# EAGLE design A3938 (EAGLE 4.16)
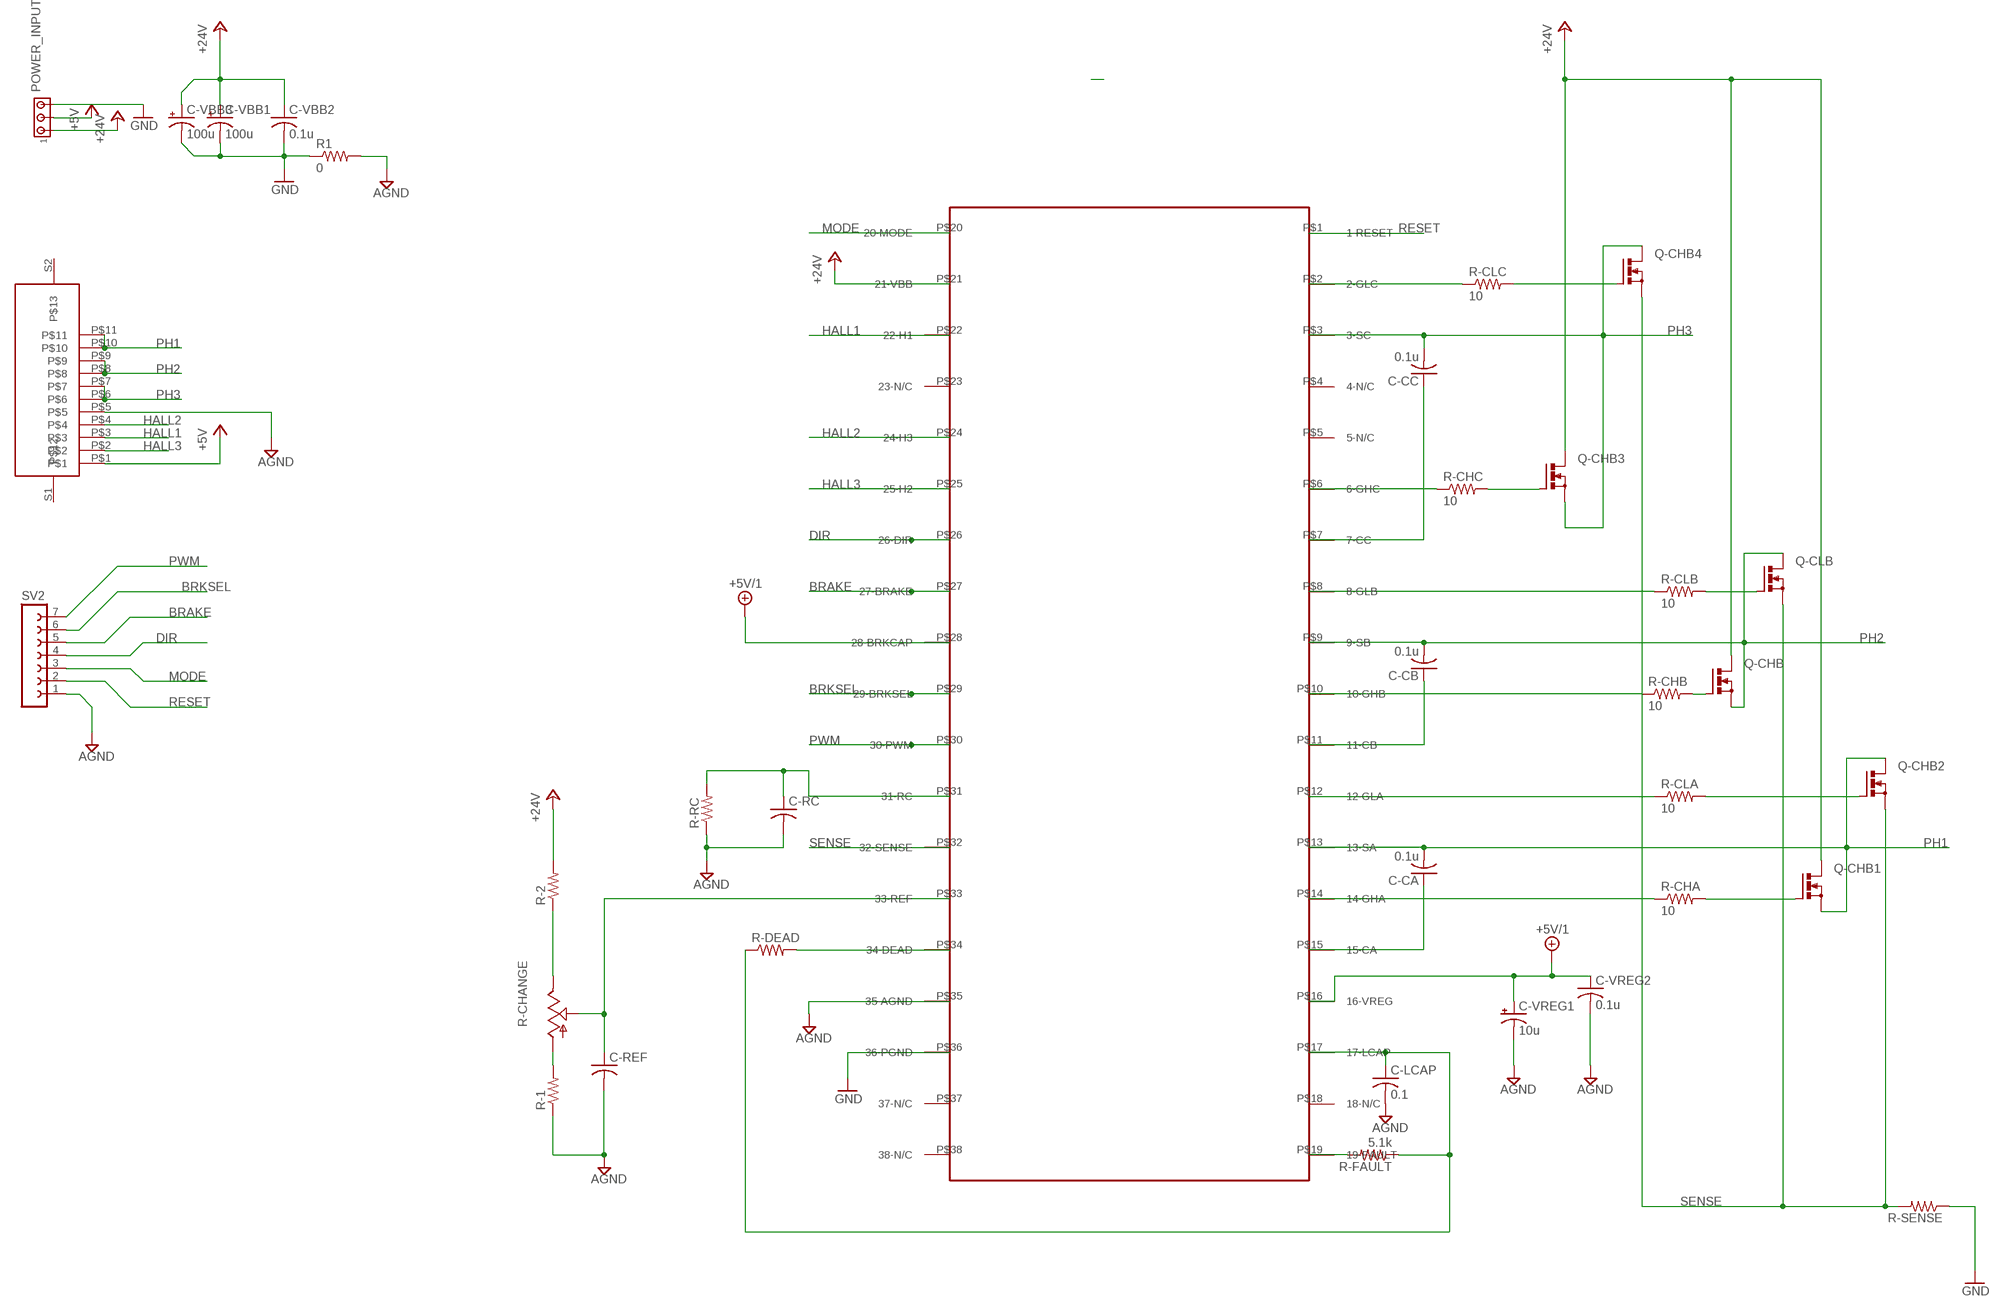
[diagram p0: schematic, sheet 1]

## Parts
C-CA  0.1u  C-USC0805  [C0805]
C-CB  0.1u  C-USC0805  [C0805]
C-CC  0.1u  C-USC0805  [C0805]
C-LCAP  0.1  C-USC0805  [C0805]
C-RC  C-USC0805  [C0805]
C-REF  C-USC0805  [C0805]
C-VBB1  100u  CPOL-USE2.5-5  [E2,5-5]
C-VBB2  0.1u  C-USC0805  [C0805]
C-VBB3  100u  CPOL-USE2.5-5  [E2,5-5]
C-VREG1  10u  CPOL-USE2.5-5  [E2,5-5]
C-VREG2  0.1u  C-USC0805  [C0805]
POWER_INPUT  MTA03-100  [10X03MTA]
Q-CHB  PMOSFET_NTO220BV  [TO220BV]
Q-CHB1  PMOSFET_NTO220BV  [TO220BV]
Q-CHB2  PMOSFET_NTO220BV  [TO220BV]
Q-CHB3  PMOSFET_NTO220BV  [TO220BV]
Q-CHB4  PMOSFET_NTO220BV  [TO220BV]
Q-CLB  PMOSFET_NTO220BV  [TO220BV]
R1  0  R-US_R0805  [R0805]
R-1  R-US_R0805  [R0805]
R-2  R-US_R0805  [R0805]
R-CHA  10  R-US_R0805  [R0805]
R-CHANGE  TRIM_US-B25U  [B25U]
R-CHB  10  R-US_R0805  [R0805]
R-CHC  10  R-US_R0805  [R0805]
R-CLA  10  R-US_R0805  [R0805]
R-CLB  10  R-US_R0805  [R0805]
R-CLC  10  R-US_R0805  [R0805]
R-DEAD  R-US_R0805  [R0805]
R-FAULT  5.1k  R-US_R0805  [R0805]
R-RC  R-US_R0805  [R0805]
R-SENSE  R-US_R0805  [R0805]
SV2  FE07-1  [FE07]
U$1  MAINCHIP  [MAINCHIP]
U$2  MOTORCONNECT  [53261-11]

## Nets
+5V: POWER_INPUT.2 U$2.P$1
+5V/1: C-VREG1.+ C-VREG2.1 U$1.P$16(16-VREG) U$1.P$28(28-BRKCAP)
+24V: C-VBB1.+ C-VBB2.1 C-VBB3.+ POWER_INPUT.1 Q-CHB1.D Q-CHB3.D Q-CHB.D R-2.2 U$1.P$21(21-VBB)
AGND: C-LCAP.2 C-RC.2 C-REF.2 C-VREG1.- C-VREG2.2 R1.2 R-1.1 R-RC.1 SV2.1 U$1.P$35(35-AGND) U$2.P$5
BRAKE: SV2.5 U$1.P$27(27-BRAKE)
BRKSEL: SV2.6 U$1.P$29(29-BRKSEL)
DIR: SV2.4 U$1.P$26(26-DIR)
GND: C-VBB1.- C-VBB2.2 C-VBB3.- POWER_INPUT.3 R1.1 R-SENSE.1 U$1.P$36(36-PGND)
HALL1: U$1.P$22(22-H1) U$2.P$3
HALL2: U$1.P$24(24-H3) U$2.P$4
HALL3: U$1.P$25(25-H2) U$2.P$2
LCAP: C-LCAP.1 R-DEAD.1 R-FAULT.1 U$1.P$17(17-LCAP)
MODE: SV2.3 U$1.P$20(20-MODE)
N$1: R-CLC.1 U$1.P$2(2-GLC)
N$2: R-CHC.1 U$1.P$6(6-GHC)
N$3: Q-CHB3.G R-CHC.2
N$4: Q-CHB4.G R-CLC.2
N$5: Q-CHB.G R-CHB.2
N$6: R-CHB.1 U$1.P$10(10-GHB)
N$7: R-CLB.1 U$1.P$8(8-GLB)
N$8: R-CHA.1 U$1.P$14(14-GHA)
N$9: R-FAULT.2 U$1.P$19(19-FAULT)
N$10: C-CA.1 U$1.P$15(15-CA)
N$11: Q-CHB1.G R-CHA.2
N$15: R-CLA.1 U$1.P$12(12-GLA)
N$16: Q-CHB2.G R-CLA.2
N$17: C-RC.1 R-RC.2 U$1.P$31(31-RC)
N$18: C-CB.1 U$1.P$11(11-CB)
N$19: C-CC.1 U$1.P$7(7-CC)
N$20: Q-CLB.G R-CLB.2
N$22: R-DEAD.2 U$1.P$34(34-DEAD)
N$24: C-REF.1 R-CHANGE.S U$1.P$33(33-REF)
N$30: R-2.1 R-CHANGE.E
N$31: R-1.2 R-CHANGE.A
PH1: C-CA.2 Q-CHB1.S Q-CHB2.D U$1.P$13(13-SA) U$2.P$10 U$2.P$11
PH2: C-CB.2 Q-CHB.S Q-CLB.D U$1.P$9(9-SB) U$2.P$8 U$2.P$9
PH3: C-CC.2 Q-CHB3.S Q-CHB4.D U$1.P$3(3-SC) U$2.P$6 U$2.P$7
PWM: SV2.7 U$1.P$30(30-PWM)
RESET: SV2.2 U$1.P$1(1-RESET)
SENSE: Q-CHB2.S Q-CHB4.S Q-CLB.S R-SENSE.2 U$1.P$32(32-SENSE)
Unconnected: U$1.P$4(4-N/C) U$1.P$5(5-N/C) U$1.P$18(18-N/C) U$1.P$23(23-N/C) U$1.P$37(37-N/C) U$1.P$38(38-N/C) U$2.S1 U$2.S2

## Library data of the parts
C-CA C-CB C-CC C-LCAP C-RC C-REF C-VBB2 C-VREG2 = rcl:C-US: CAPACITOR, American symbol
C-VBB1 C-VBB3 C-VREG1 = rcl:CPOL-US: POLARIZED CAPACITOR, American symbol
POWER_INPUT = con-amp:MTA03-100: AMP connector
Q-CHB Q-CHB1-Q-CHB4 Q-CLB = transistor-power:PMOSFET_N: Power MOSFET N-Channel
R1 R-1 R-2 R-CHA R-CHB R-CHC R-CLA R-CLB R-CLC R-DEAD R-FAULT R-RC R-SENSE = rcl:R-US_: RESISTOR, American symbol
R-CHANGE = pot:TRIM_US-: POTENTIOMETER
SV2 = con-lsta:FE07-1: FEMALE HEADER
U$1 = A3938:MAINCHIP
U$2 = brushless:MOTORCONNECT

## Board
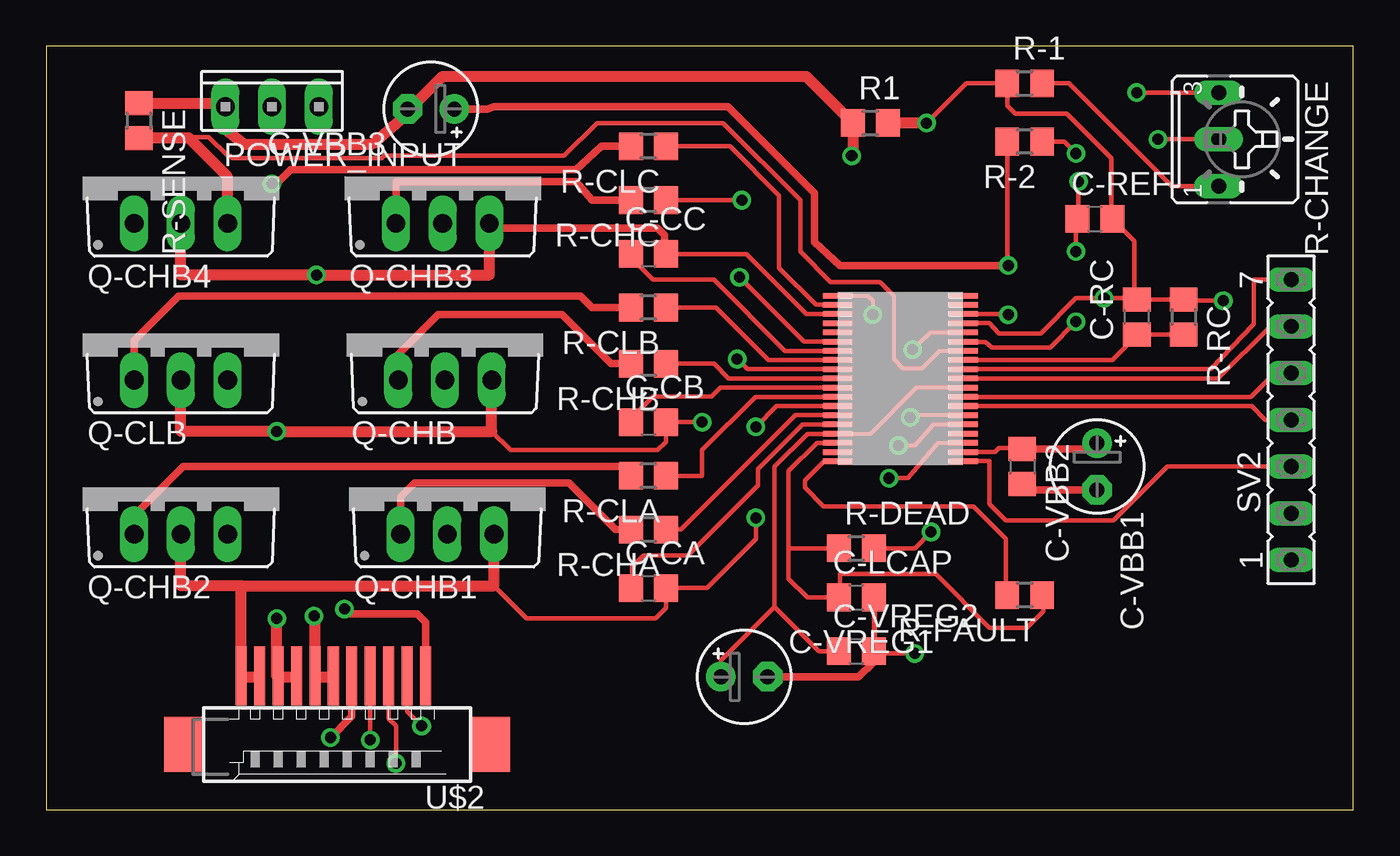
[diagram p1: board, top side]
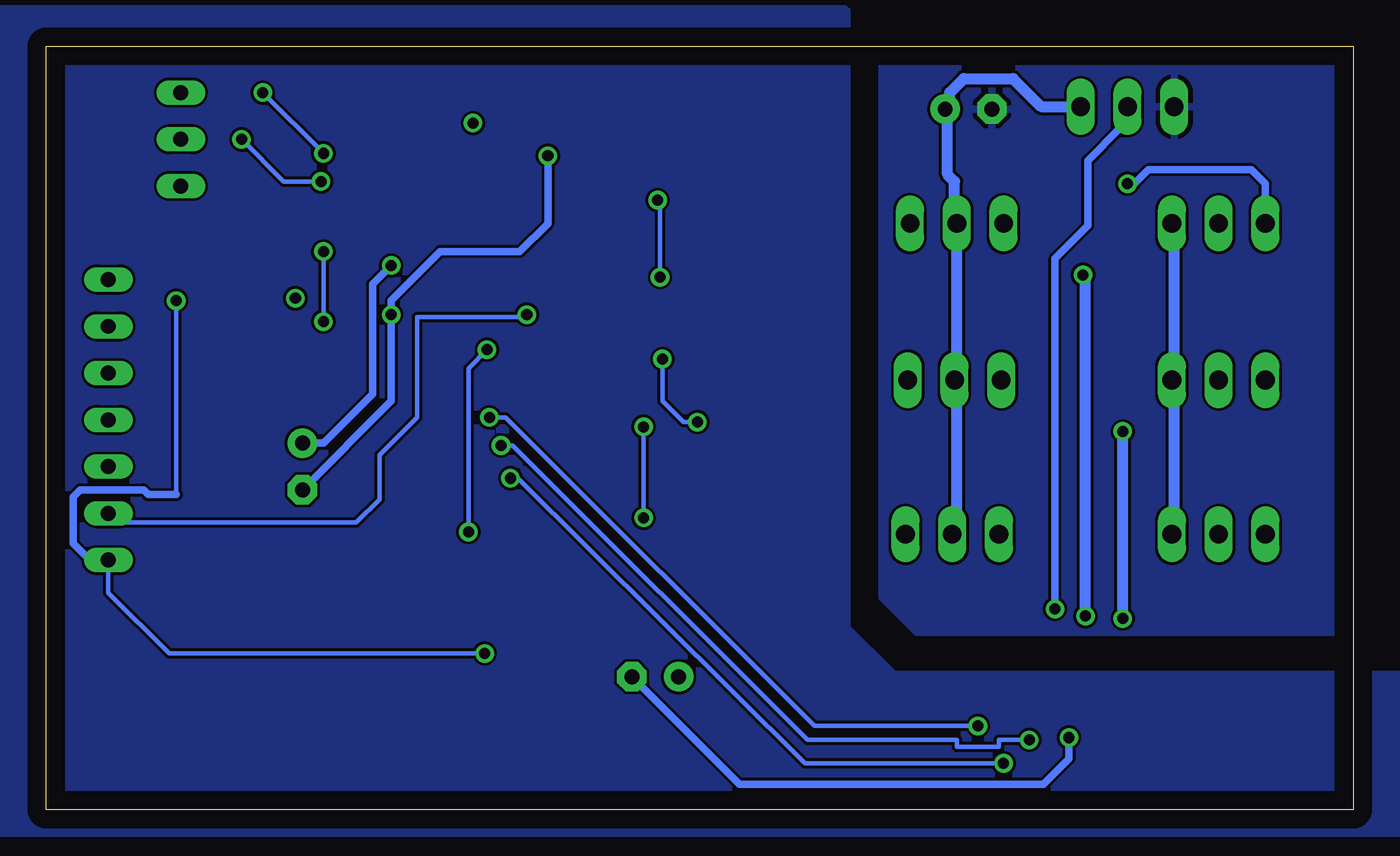
[diagram p2: board, bottom side, seen from below]

Size 71.04 x 41.52 mm. Coordinates in mm from the lower left corner, seen from the top.
Outline: 0,0 71.04,0 71.04,41.52 0,41.52 0,0
Copper layers (1*16): Top 0.035mm / dielectric 1.5mm / Bottom 0.035mm
Design rules "default": minimum track width 10mil, minimum drill 15mil, track to track 6mil, track to pad 6mil, pad to pad 6mil, via to via 8mil, smd to smd 6mil, copper to edge 40mil, drill to drill 8mil, minimum pad ring 10mil, minimum via ring 8mil, stop-mask expansion 4mil, vias tented up to drill 0mil, thermal gap 10mil

### Footprints (pad centres in the part's own frame; a part is rotated, then mirrored left to right if it is on the bottom)
C0805 = smd 1.3 x 1.5: 1 -0.95,0; 2 0.95,0
E2,5-5 = drill 0.813 pad 1.6 round: + -1.27,0 | drill 0.813 pad 1.6 octagon: - 1.27,0
10X03MTA = drill 1.016 long: 1 2.54,0; 2 0,0; 3 -2.54,0
TO220BV = drill 1.016 long: D 0,-2.54; G -2.54,-2.54; S 2.54,-2.54
R0805 = smd 1.3 x 1.5: 1 -0.95,0; 2 0.95,0
B25U = drill 0.813 long: A 2.54,-0.889; E -2.54,-0.889; S 0,-0.889
FE07 = drill 0.813 long: 1 -7.62,0; 2 -5.08,0; 3 -2.54,0; 4 0,0; 5 2.54,0; 6 5.08,0; 7 7.62,0
MAINCHIP = smd 0.3 x 1.6: P$1 -4.6,-1.5; P$2 -4.1,-1.5; P$3 -3.6,-1.5; P$4 -3.1,-1.5; P$5 -2.6,-1.5; P$6 -2.1,-1.5; P$7 -1.6,-1.5; P$8 -1.1,-1.5; P$9 -0.6,-1.5; P$10 -0.1,-1.5; P$11 0.4,-1.5; P$12 0.9,-1.5; P$13 1.4,-1.5; P$14 1.9,-1.5; P$15 2.4,-1.5; P$16 2.9,-1.5; P$17 3.4,-1.5; P$18 3.9,-1.5; P$19 4.4,-1.5; P$20 4.4,5.3; P$21 3.9,5.3; P$22 3.4,5.3; P$23 2.9,5.3; P$24 2.4,5.3; P$25 1.9,5.3; P$26 1.4,5.3; P$27 0.9,5.3; P$28 0.4,5.3; P$29 -0.1,5.3; P$30 -0.6,5.3; P$31 -1.1,5.3; P$32 -1.6,5.3; P$33 -2.1,5.3; P$34 -2.6,5.3; P$35 -3.1,5.3; P$36 -3.6,5.3; P$37 -4.1,5.3; P$38 -4.6,5.3
53261-11 = smd 0.6 x 3.2: P$1 -3,-3.1; P$2 -2,-3.1; P$3 -1,-3.1; P$4 0,-3.1; P$5 1,-3.1; P$6 2,-3.1; P$7 3,-3.1; P$8 4,-3.1; P$9 5,-3.1; P$10 6,-3.1; P$11 7,-3.1 | smd 2.1 x 3: S1 10.15,0.625; S2 -6.55,0.625

### Placement (x,y rotation side)
C-CA  32.73,12.06 0 top
C-CB  32.73,21.08 0 top
C-CC  32.73,30.22 0 top
C-LCAP  44.03,11.55 0 top
C-RC  59.27,26.79 90 top
C-REF  56.98,32.13 0 top
C-VBB1  57.11,18.66 270 top
C-VBB2  53.05,18.66 270 top
C-VBB3  20.92,38.1 180 top
C-VREG1  37.94,7.23 0 top
C-VREG2  44.03,8.63 0 top
POWER_INPUT  12.28,38.22 0 top
Q-CHB  21.68,25.9 0 top
Q-CHB1  21.81,17.52 0 top
Q-CHB2  7.33,17.52 0 top
Q-CHB3  21.55,34.41 0 top
Q-CHB4  7.33,34.41 0 top
Q-CLB  7.33,25.9 0 top
R1  44.79,37.33 0 top
R-1  53.18,39.49 0 top
R-2  53.18,36.32 180 top
R-CHA  32.73,15.24 180 top
R-CHANGE  64.61,36.44 270 top
R-CHB  32.73,24.25 180 top
R-CHC  32.73,33.14 180 top
R-CLA  32.73,18.16 180 top
R-CLB  32.73,27.3 180 top
R-CLC  32.73,36.06 180 top
R-DEAD  44.03,14.22 0 top
R-FAULT  53.18,11.68 180 top
R-RC  61.81,26.79 270 top
R-SENSE  5.04,37.46 270 top
SV2  67.65,21.2 90 top
U$1  44.53,23.35 270 top
U$2  17.61,4.19 180 top

### Tracks (layer width: path | path; a pad name or v marks a point on that pad's centre or on a via)
+5V  (via drill 0.6)
  Top 0.254: 16.47,10.66 v16.22,10.92
  Top 0.406: U$2.P$1 20.61,10.2 20.15,10.66 16.47,10.66
  Bottom 0.406: v16.22,10.92 16.22,29.97 14.44,31.74 14.44,35.3 12.66,37.08 12.66,38.1 12.41,38.35 POWER_INPUT.2
+5V/1
  Top 0.254: C-VREG2.1 42,8.63 39.59,11.04 | 39.59,11.04 39.59,18.66 41.36,20.44 42.76,20.44 42.77,20.45 U$1.P$16 42.9,20.45 42.89,20.44 44.79,20.44 47.3,22.95 U$1.P$28 | 39.59,11.04 36.66,8.12 C-VREG1.+
+24V  (via drill 0.6)
  Top 0.254: U$1.P$21 51.55,19.45 51.78,19.68 53.05,19.68 C-VBB2.1 | R-2.2 52.23,29.65 v52.29,29.59
  Top 0.406: C-VBB2.1 56.79,19.61 C-VBB1.+ | v52.29,29.59 43.14,29.59 41.75,30.86 41.75,33.52 37.05,38.22 24.35,38.22 23.96,38.1 C-VBB3.+
  Bottom 0.406: C-VBB1.+ 55.97,19.93 53.3,22.6 53.3,28.57 v52.29,29.59
  Bottom 0.61: 21.55,23.36 21.55,23.11 | 21.55,23.36 Q-CHB3.D 21.43,31.87 | 21.55,14.98 21.55,14.73 | 21.55,14.98 Q-CHB1.D | 21.55,23.36 Q-CHB.D | 21.55,14.98 21.55,23.36 | POWER_INPUT.1 16.98,38.22 18.5,39.75 21.17,39.75 21.93,38.98 21.93,38.1 22.06,37.97 | 22.06,37.97 C-VBB3.+ | 22.06,37.97 22.06,34.54 21.68,34.16 21.68,32.13 21.43,31.87 | 21.43,31.87 21.3,31.74
AGND  (via drill 0.6)
  Top 0.254: 61.81,27.68 R-RC.1 | C-RC.2 61.75,27.74 61.81,27.68 | 44.98,11.61 C-LCAP.2 | 44.98,11.61 C-VREG2.2 44.98,8.57 45.05,8.5 | 44.98,11.61 45.05,11.68 45.05,8.5 | 44.92,8 44.92,8.38 45.05,8.5 | v47.84,37.33 50,39.49 R-1.1 52.23,38.28 52.67,37.84 55.46,37.84 57.87,35.43 57.87,32.13 C-REF.2 59.14,30.92 59.14,27.81 | U$1.P$35 49.85,26.46 51.25,26.46 51.78,25.9 54.06,25.9 55.97,27.81 v57.49,27.81 59.14,27.81 | C-RC.2 59.27,27.81 59.14,27.81 | 59.14,27.81 59.21,27.81 C-RC.2 | v63.97,27.68 61.81,27.68 | SV2.1 67.53,13.58 | U$2.P$5 16.6,7.27 | 45.05,8.5 v47.21,8.5
  Top 0.406: C-VREG1.- 44.16,7.23 44.92,8 | 16.6,7.27 16.6,5.08 v15.46,3.93
  Top 0.61: v47.84,37.33 R1.2
  Bottom 0.254: 63.97,17.14 v63.97,27.68 | v47.21,8.5 64.35,8.5 67.65,11.81 SV2.1
  Bottom 0.406: C-VREG1.- 33.36,1.39 16.85,1.39 15.46,2.79 v15.46,3.93 | 63.97,17.14 65.49,17.14 65.75,17.39 69.18,17.39 69.56,17.01 69.56,14.47 68.92,13.84 68.16,13.84 67.91,13.58 SV2.1
ANGD
  pour Bottom: 27.52,43.43 27.52,9.9 24.98,7.36 -2.96,7.36 -2.96,-1.27 73.62,-1.27 73.62,43.56 27.65,43.56
BRAKE
  Top 0.254: U$1.P$27 65.47,22.45 66.76,23.74 SV2.5
BRKSEL
  Top 0.254: U$1.P$29 63.68,23.45 66.51,26.28 SV2.6 67.78,26.16
DIR
  Top 0.254: U$1.P$26 65.51,21.95 66.26,21.2 SV2.4
GND  (via drill 0.6)
  Top 0.254: C-VBB2.2 53.05,17.77 53.43,17.39 | U$1.P$36 52.25,26.95 v52.29,26.92 | C-VBB3.- 19.52,38.22 19.9,38.22
  Top 0.406: C-VBB1.- 53.43,17.39 | 43.84,35.62 v43.78,35.55
  Top 0.61: R-SENSE.1 9.43,38.41 9.61,38.22 POWER_INPUT.3 9.87,38.22 9.61,37.97 9.61,37.08 10.76,36.19 17.74,36.19 19.65,37.84 C-VBB3.- | 43.84,35.62 R1.1 41.3,39.87 21.55,39.87 19.9,38.22
  Bottom 0.406: C-VBB1.- 52.29,22.22 v52.29,26.92 52.29,27.68 49.62,30.35 45.3,30.35 43.78,31.87 v43.78,35.55
  pour Bottom: 23.71,9.65 25.62,11.55 25.62,43.3 -2.83,43.3 -2.83,9.65
HALL1  (via drill 0.6)
  Top 0.254: U$2.P$3 18.61,4.96 19.01,4.57 v19.01,2.54 | v45.81,18.03 46.83,18.03 48.48,19.93 49.87,19.93 49.85,19.95 U$1.P$22
  Bottom 0.254: v45.81,18.03 45.43,18.03 29.81,2.54 v19.01,2.54
HALL2  (via drill 0.6)
  Top 0.254: v17.61,3.8 U$2.P$4 | v46.32,19.81 47.21,19.81 48.22,20.95 49.75,20.95 U$1.P$24
  Bottom 0.254: v17.61,3.8 19.27,3.8 19.27,3.42 21.55,3.42 21.55,3.8 29.68,3.8 45.68,19.81 v46.32,19.81
HALL3  (via drill 0.6)
  Top 0.254: U$2.P$2 19.61,5.36 v20.41,4.57 | v46.95,21.33 47.46,21.46 49.75,21.46 49.75,21.45 U$1.P$25
  Bottom 0.254: v20.41,4.57 29.3,4.57 46.06,21.33 v46.95,21.33 47.08,21.33
LCAP
  Top 0.254: U$1.P$17 41.89,19.95 40.35,18.41 40.35,14.22 | 40.35,14.22 40.35,12.57 41.36,11.55 C-LCAP.1 43.14,11.61 43.14,12.82 48.35,12.82 51.27,9.9 53.3,9.9 54.19,10.79 54.19,11.61 R-FAULT.1 | 40.35,14.22 R-DEAD.1
MODE
  Top 0.254: U$1.P$20 51.27,18.95 51.27,16.63 52.16,15.74 58,15.74 60.92,18.66 67.53,18.66 67.65,18.79 SV2.3
N$1
  Top 0.254: U$1.P$2 41.85,27.45 39.84,29.46 39.84,33.4 37.17,36.06 33.87,36.06 33.74,35.94 33.68,36 R-CLC.1
N$2  (via drill 0.6)
  Top 0.254: U$1.P$6 41.18,25.45 v37.68,28.95 | R-CHC.1 33.62,33.14 | 33.62,33.14 v37.81,33.14 | 33.62,33.14 33.49,33.27
  Bottom 0.254: v37.68,28.95 37.68,33.02 v37.81,33.14
N$3
  Top 0.254: Q-CHB3.G 19.01,31.74 | R-CHC.2 31.58,33.14 31.46,33.02 31.33,33.14
  Top 0.406: Q-CHB3.G 19.01,34.16 28.79,34.16 29.68,33.14 31.33,33.14
N$4  (via drill 0.6)
  Top 0.254: v12.28,34.03 12.54,34.03
  Top 0.406: 12.54,34.03 13.3,34.79 28.79,34.79 30.19,36.06 R-CLC.2
  Bottom 0.254: 11.9,34.03 v12.28,34.03
  Bottom 0.406: Q-CHB4.G 4.79,34.03 5.55,34.79 11.14,34.79 11.9,34.03
N$5
  Top 0.254: R-CHB.2 31.71,24.25 31.58,24.12 31.46,24.25
  Top 0.406: Q-CHB.G 19.14,24.76 21.3,26.92 28.03,26.92 30.7,24.25 31.46,24.25
N$6
  Top 0.254: U$1.P$10 37.08,23.45 36.28,24.25 R-CHB.1
N$7
  Top 0.254: U$1.P$8 39.26,24.45 36.41,27.3 R-CLB.1 33.49,27.3
N$8
  Top 0.254: U$1.P$14 40.72,21.45 34.51,15.24 R-CHA.1
N$9
  Top 0.254: U$1.P$19 42.99,18.92 42.25,18.92 41.24,17.9 41.24,17.52 42.25,16.5 50.38,16.5 52.16,14.73 52.16,11.68 R-FAULT.2
N$10
  Top 0.254: U$1.P$15 41.11,20.95 38.7,18.54 38.7,17.65 34.89,13.84 32.47,13.84 31.84,13.2 31.84,12.06 C-CA.1
N$11
  Top 0.254: R-CHA.2 31.71,15.24 31.58,15.11 31.46,15.24
  Top 0.406: Q-CHB1.G 19.27,17.01 20.03,17.77 28.41,17.77 30.95,15.24 31.46,15.24
N$15
  Top 0.254: U$1.P$12 38.55,22.45 35.65,19.55 35.65,18.16 33.74,18.16 33.68,18.09 | 33.68,18.09 33.62,18.03 | R-CLA.1 33.68,18.09
N$16
  Top 0.254: R-CLA.2 31.58,18.16 31.08,18.66
  Top 0.406: Q-CHB2.G 4.79,16 7.45,18.66 31.08,18.66
N$17
  Top 0.254: U$1.P$31 57.95,24.45 59.27,25.78 C-RC.1 61.75,25.84 61.81,25.78 R-RC.2
N$18
  Top 0.254: U$1.P$11 36.64,22.95 36.16,22.47 32.98,22.47 31.58,21.08 C-CB.1
N$19
  Top 0.254: U$1.P$7 40.16,24.95 36.28,28.82 32.98,28.82 31.71,30.09 31.78,30.16 C-CC.1
N$20
  Top 0.254: R-CLB.2 31.78,27.24 31.71,27.17 31.58,27.3
  Top 0.406: Q-CLB.G 4.79,25.52 7.2,27.93 29.04,27.93 29.68,27.3 31.58,27.3
N$22  (via drill 0.6)
  Top 0.254: R-DEAD.2 47.21,14.22 v48.1,15.11 | v47.08,25.01 48.05,25.96 U$1.P$34 49.8,25.95 U$1.P$34
  Bottom 0.254: v48.1,15.11 48.1,24 v47.08,25.01
N$24  (via drill 0.6)
  Top 0.254: v60.41,36.44 R-CHANGE.S | v56.1,34.16 56.1,32.13 C-REF.1 55.97,32.13 v55.97,30.35 | U$1.P$33 49.93,25.43 51.05,25.43 51.4,25.14 54.57,25.14 v55.97,26.54
  Bottom 0.254: v60.41,36.44 58.13,34.16 v56.1,34.16 | v55.97,26.54 v55.97,30.35
N$30  (via drill 0.6)
  Top 0.254: R-2.1 55.33,36.32 v55.97,35.68 | v59.27,38.98 R-CHANGE.E
  Bottom 0.254: v55.97,35.68 v59.27,38.98
N$31
  Top 0.254: R-1.2 55.59,39.49 61.18,33.9 R-CHANGE.A 63.84,33.9
PH1  (via drill 0.6)
  Top 0.254: U$1.P$13 39.7,21.95 v38.57,20.82 | v38.57,15.87 38.57,14.73 35.9,12.06 C-CA.2 33.68,10.98 33.11,10.41 26.12,10.41 24.35,12.19
  Top 0.61: Q-CHB2.D 7.33,12.19 10.63,12.19 | 10.63,12.19 24.35,12.19 Q-CHB1.S 24.47,14.98 | U$2.P$10 11.61,7.23 10.61,7.23 U$2.P$11 10.61,12.19 10.63,12.19
  Bottom 0.254: v38.57,15.87 v38.57,20.82
PH2  (via drill 0.6)
  Top 0.254: U$1.P$9 38.11,23.95 v37.55,24.51 | C-CB.2 33.62,21.08 | C-CB.2 v35.65,21.08 | C-CB.2 33.68,19.99 33.24,19.55 25.23,19.55 24.22,20.57
  Top 0.61: Q-CLB.D 7.33,20.57 v12.54,20.57 24.22,20.57 Q-CHB.S 24.35,23.36 | 12.61,7.23 12.54,7.23 v12.54,10.41 | U$2.P$9 12.61,7.23 | U$2.P$8 13.61,7.23 12.61,7.23
  Bottom 0.254: v35.65,21.08 36.41,21.08 37.55,22.22 v37.55,24.51
  Bottom 0.61: v12.54,10.41 v12.54,20.57
PH3  (via drill 0.6)
  Top 0.254: 24.09,30.6 24.22,30.73 | U$1.P$3 41.33,26.95 38.06,30.22 C-CC.2 | C-CC.2 33.49,30.22 | 23.71,31.62 23.96,31.87 Q-CHB3.S | C-CC.2 33.68,30.67 33.62,30.73
  Top 0.406: 33.62,30.73 33.62,31.24 33.24,31.62 23.71,31.62
  Top 0.61: Q-CHB4.D 7.33,29.08 v14.69,29.08 24.09,29.08 24.09,30.6 Q-CHB3.S | U$2.P$6 15.61,7.23 14.61,7.23 U$2.P$7 14.61,10.54 v14.57,10.54
  Bottom 0.61: v14.57,10.54 14.57,29.08 v14.69,29.08
PWM
  Top 0.254: U$1.P$30 63.29,23.95 65.62,26.41 65.62,28.82 SV2.7
RESET  (via drill 0.6)
  Top 0.254: U$1.P$1 43.05,27.93 44.67,27.93 44.92,27.68 v44.92,26.92
  Bottom 0.254: v44.92,26.92 45.05,26.79 50.89,26.79 50.89,21.33 52.92,19.3 52.92,16.89 54.19,15.62 67.02,15.62 67.53,16.12 SV2.2 67.78,16.12
SENSE
  Top 0.254: U$1.P$32 48.54,24.95 47.59,24 46.57,24 46.06,24.51 46.06,27.93 45.3,28.7 42.63,28.7 40.98,30.35 40.98,33.14 36.79,37.33 29.93,37.33 28.16,35.55 18.38,35.55 18.25,35.43 10.12,35.43 10,35.55 9.87,35.55 8.85,36.57 7.84,36.57 7.71,36.44 7.71,36.51
  Top 0.61: R-SENSE.2 7.71,36.51 7.77,36.51 9.87,34.41 Q-CHB4.S
  Bottom 0.61: 9.74,23.36 9.74,23.11 | Q-CHB4.S 9.74,31.87 9.74,23.36 | 9.74,14.98 9.74,14.6 | Q-CHB2.S 9.74,14.98 | 9.74,23.36 Q-CLB.S | 9.74,14.98 9.74,23.36